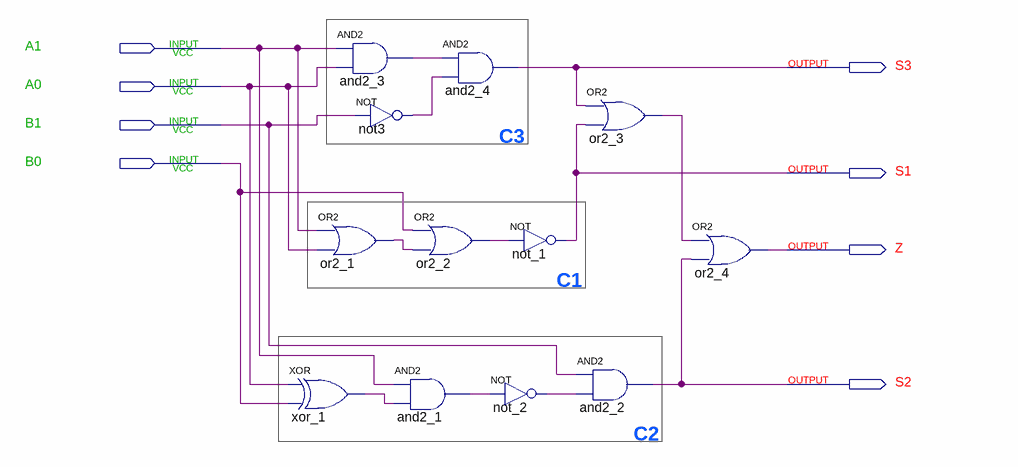
[diagram p0: schematic sheet]
// Quartus schematic exp02_3.bdf as structural Verilog: 12 symbols, 8 pins
module exp02_3 (
  input  A1,
  input  A0,
  input  B1,
  input  B0,
  output S3,
  output S1,
  output Z,
  output S2
);

  wire and2_1_out, and2_3_out, not3_out, not_2_out, or2_1_out, or2_2_out, or2_3_out, xor_1_out;

  or or2_1 (or2_1_out, A1, A0);
  xor xor_1 (xor_1_out, A0, B0);
  and and2_3 (and2_3_out, A1, A0);
  not not3 (not3_out, B1);
  and and2_1 (and2_1_out, A1, xor_1_out);
  and and2_4 (S3, and2_3_out, not3_out);
  or or2_2 (or2_2_out, B0, or2_1_out);
  not not_1 (S1, or2_2_out);
  not not_2 (not_2_out, and2_1_out);
  or or2_3 (or2_3_out, S3, S1);
  and and2_2 (S2, B1, not_2_out);
  or or2_4 (Z, or2_3_out, S2);

  // Notes on the sheet:
  //   C3
  //   C1
  //   C2
endmodule
